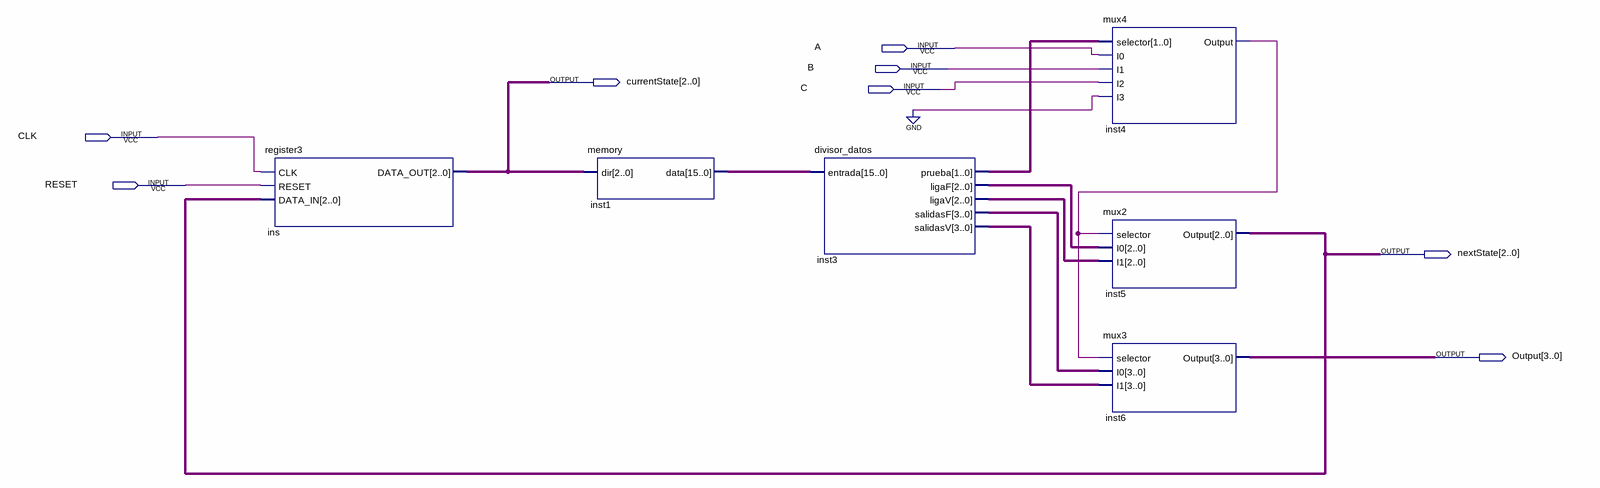
[diagram p0: schematic sheet]
// Quartus schematic prac4.bdf as structural Verilog: 6 symbols, 8 pins
module prac4 (
  input  A,
  input  B,
  input  C,
  input  CLK,
  input  RESET,
  output [2:0] currentState,
  output [2:0] nextState,
  output [3:0] Output
);

  wire inst4_output;
  wire [1:0] inst3_prueba;
  wire [2:0] inst3_ligaf, inst3_ligav;
  wire [3:0] inst3_salidasf, inst3_salidasv;
  wire [15:0] inst1_data;

  register3 ins (.CLK(CLK), .RESET(RESET), .DATA_IN(nextState), .DATA_OUT(currentState));
  memory inst1 (.dir(currentState), .data(inst1_data));
  divisor_datos inst3 (
    .entrada(inst1_data), .prueba(inst3_prueba), .ligaF(inst3_ligaf), .ligaV(inst3_ligav),
    .salidasF(inst3_salidasf), .salidasV(inst3_salidasv));
  mux4 inst4 (.selector(inst3_prueba), .I0(A), .I1(B), .I2(C), .I3(1'b0), .Output(inst4_output));
  mux2 inst5 (.selector(inst4_output), .I0(inst3_ligaf), .I1(inst3_ligav), .Output(nextState));
  mux3 inst6 (.selector(inst4_output), .I0(inst3_salidasf), .I1(inst3_salidasv), .Output(Output));
endmodule
